# Altium schematic sheet isolation_block.SchDoc
size 420 x 297 mm; DocumentNumber: ТБ.468266.001; SheetNumber: 2; SheetTotal: 11; Razrabotal: Шляков
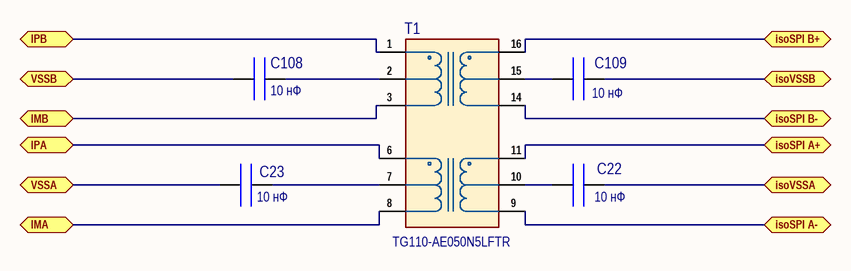
[diagram p0: isolation_block.SchDoc]

## Parts
C22  value 10 нФ  [CC0402(1005)]  (hidden comment: CC0402-X7R-10 нФ-20%-50В)
C23  value 10 нФ  [CC0402(1005)]  (hidden comment: CC0402-X7R-10 нФ-20%-50В)
C108  value 10 нФ  [CC0402(1005)]  (hidden comment: CC0402-X7R-10 нФ-20%-50В)
C109  value 10 нФ  [CC0402(1005)]  (hidden comment: CC0402-X7R-10 нФ-20%-50В)
T1  TG110-AE050N5  [SMT4_SOIC16_N5]  (value not drawn)

## Ports
IMA (bidir), IMB (bidir), IPA (bidir), IPB (bidir), isoSPI A+ (bidir), isoSPI A- (bidir), isoSPI B+ (bidir), isoSPI B- (bidir), isoVSSA (bidir), isoVSSB (bidir), VSSA (bidir), VSSB (bidir)

## Nets
IMA: T1.8(P2_2) ; port IMA
IMB: T1.3(P1_2) ; port IMB
IPA: T1.6(P2_1) ; port IPA
IPB: T1.1(P1_1) ; port IPB
isoSPI A+: T1.11(S2_N) ; port isoSPI A+
isoSPI A-: T1.9(S2_P) ; port isoSPI A-
isoSPI B+: T1.16(S1_N) ; port isoSPI B+
isoSPI B-: T1.14(S1_P) ; port isoSPI B-
isoVSSA: C22.2(-) ; port isoVSSA
isoVSSB: C109.2(-) ; port isoVSSB
VSSA: C23.1(+) ; port VSSA
VSSB: C108.1(+) ; port VSSB
NetC22_1: C22.1(+) T1.10(S2_T)
NetC23_2: C23.2(-) T1.7(P2_T)
NetC108_2: C108.2(-) T1.2(P1_T)
NetC109_1: C109.1(+) T1.15(S1_T)

Not connected (* = marked no-connect by the designer): T1 4(NC@1) 5(NC@2) 12(NC@4) 13(NC@3)

## Notes on the sheet
- Подп. и дата
- Инв. № дубл.
- Взам. инв. №
- Инв. № подл.
- Изм.
- Лист
- № докум.
- Подп.
- Дата
- 2.106-A3
- Копировал
- Формат А3

## Library data of the parts
C22 C23 C108 C109 = CC0402-X7R-#-20%-50В: Чип конденсатор керамический; Supplier 1: Digi-Key; Supplier Part Number 1: 399-3066-1-ND
T1 = TG110-AE050N5LFTR: Halo's <b>TG110-AE050N5LFTR</b> ULTRA-Series, 16 Pin SOIC 10/100BASE-TX Magnetic Modules<br> <br> <b>Description:</b><br> <br>; Package: None; Price: None; Value: *; MP: TG110-AE050N5LFTR; Availability: Unavailable; Supplier 1: Mouser; Supplier Part Number 1: 493-TG110-AE050N5LF